# Altium project robot_control_pcb.PrjPCB
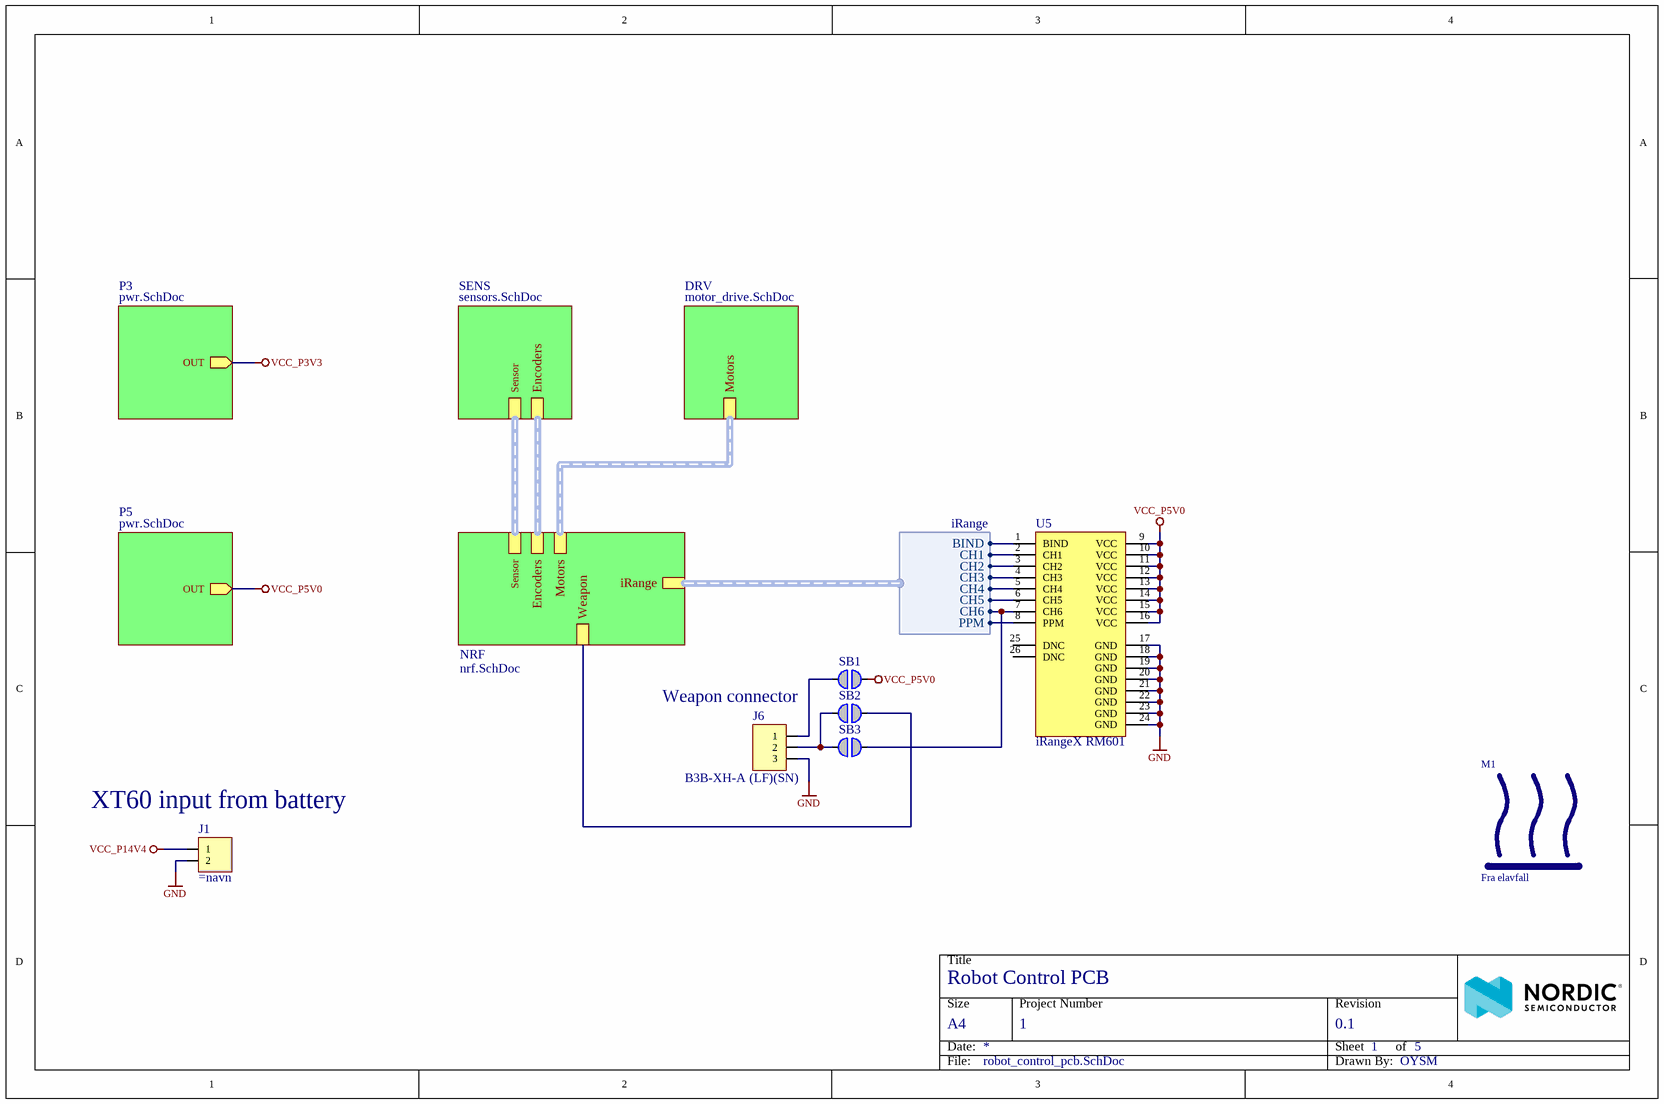
[diagram p0: robot_control_pcb.SchDoc]
5 sheets, 72 parts. Net scope: hierarchical (ports join the sheet entries above them; power ports are global).
Board file: robot_control_pcb.PcbDoc
Sheets:
  robot_control_pcb.SchDoc
    NRF = nrf.SchDoc
    DRV = motor_drive.SchDoc
    SENS = sensors.SchDoc
    P3 = pwr.SchDoc
    P5 = pwr.SchDoc

## Sheet robot_control_pcb.SchDoc: Robot Control PCB
size A4; Revision: 0.1; SheetNumber: 1; SheetTotal: 5; DrawnBy: OYSM; ProjectNumber: 1; DocumentSize: A4; PCAName: robot_control_pcb

### Parts
J1  (no value)  [XT60_Male_Vertical]
J6  B3B-XH-A (LF)(SN)  [JST_3P]
M1  Fra elavfall  [Heatsink_36x31x09]
SB1  Solderbridge  [Solderbridge]  (value not drawn)  (no BOM)
SB2  Solderbridge  [Solderbridge]  (value not drawn)  (no BOM)
SB3  Solderbridge  [Solderbridge]  (value not drawn)  (no BOM)
U5  iRangeX RM601  [iRangeX RM601]

### Sub-sheets
DRV = motor_drive.SchDoc: Motors (harness Motors)
NRF = nrf.SchDoc: Sensor (harness SENSOR), iRange (harness iRange), Encoders (harness Encoders), Motors (harness Motors), Weapon
P3 = pwr.SchDoc: OUT (out)
P5 = pwr.SchDoc: OUT (out)
SENS = sensors.SchDoc: Sensor (harness SENSOR), Encoders (harness Encoders)

### Harnesses
iRange: BIND, CH1, CH2, CH3, CH4, CH5, CH6, PPM

### Nets
GND: J1.2 J6.3 U5.17(GND) U5.18(GND) U5.19(GND) U5.20(GND) U5.21(GND) U5.22(GND) U5.23(GND) U5.24(GND)
VCC_P5V0: SB1.1 U5.9(VCC) U5.10(VCC) U5.11(VCC) U5.12(VCC) U5.13(VCC) U5.14(VCC) U5.15(VCC) U5.16(VCC) ; sheet P5/OUT
VCC_P14V4: J1.1
P0.14/WEP: SB2.1 ; sheet NRF/Weapon
P0.25/PPM: U5.8(PPM) ; sheet NRF/iRange.PPM
P0.26/CH6: SB3.1 U5.7(CH6) ; sheet NRF/iRange.CH6
P0.27/CH5: U5.6(CH5) ; sheet NRF/iRange.CH5
P0.28/CH4: U5.5(CH4) ; sheet NRF/iRange.CH4
P0.29/CH3: U5.4(CH3) ; sheet NRF/iRange.CH3
P0.30/CH2: U5.3(CH2) ; sheet NRF/iRange.CH2
P0.31/CH1: U5.2(CH1) ; sheet NRF/iRange.CH1
NetJ6_1: J6.1 SB1.2
NetJ6_2: J6.2 SB2.2 SB3.2
NetU5_1: U5.1(BIND) ; sheet NRF/iRange.BIND

Not connected (* = marked no-connect by the designer): U5 25(DNC) 26(DNC)

### Buses and harness runs
harness sheet DRV/Motors = sheet NRF/Motors
harness sheet NRF/Encoders = sheet SENS/Encoders
harness sheet NRF/Sensor = sheet SENS/Sensor

### Notes on the sheet
- Weapon connector
- (near J1) XT60 input from battery
- Title
- Size
- Date:
- A4
- Project Number
- Sheet         of
- Revision
- File:
- Drawn By:

### Library data of the parts
J1 = 4544: For å koble ledninger sammen; id: 4544
J6 = 4473: JST 3pin (pris pr. stk.); id: 4473; rad: 3; rom: OV; lager_type: Fremlager; dybde: 0; hylle: 6; antall: 100; pakke_opprettet_av: 815; leverandor_varenr: 1516277; pris: 2; nokkelord: Connector, Kontakt; leverandor: Farnell; pakketype: TH; komponenttype: 11; pakke_opprettet: 28.06.2014 18:25:12; symbol_opprettet_av: 815; symbol_opprettet: 28.06.2014 15:33:24; navn: B3B-XH-A (LF)(SN); produsent: JST
M1 = Heatsink
SB1-SB3 = Solderbridge: Artikkelnr Noca: N.A.; Part Number: Solderbridge; Manufacturer: *; Manufacturer Part Number: *; ComponentLink1URL: *; ComponentLink1Description: Datasheet; ComponentLink2URL: *; ComponentLink2Description: Supplier link; HelpURL: *; Footprint Doc: Solderbridge; LatestRevisionDate: 2009-12-14; Pin Count: 2; Publisher: Nordic Semiconductor; Published: 2009-12-14; Value: Solderbridge; Note: *; Supplier 1: *; Supplier Part Number 1: *; Supplier 2: *; Supplier Part Number 2: *; Part number IPS: N.A.

## Sheet nrf.SchDoc: PCA70107 MCU
size A4; DocumentNumber: 2; Revision: 0; SheetNumber: 2; SheetTotal: 5; ProjectNumber: <Project number>; DocumentSize: A4; PCBRevision: <PCB designer code>
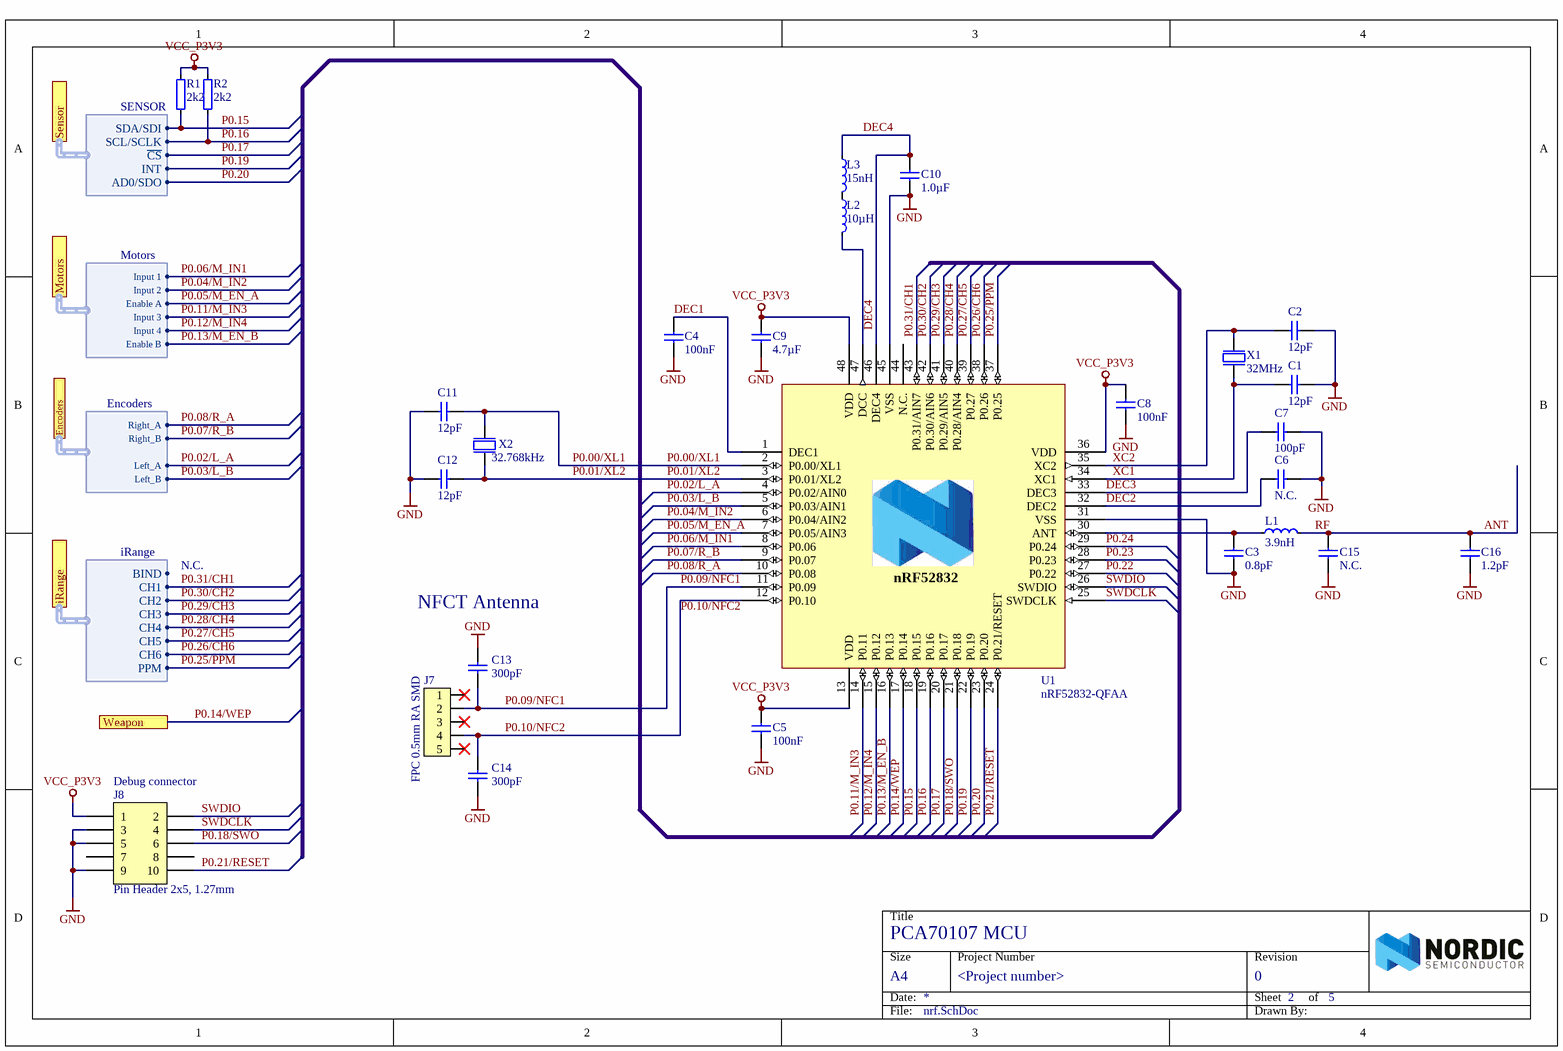
[diagram p1: nrf.SchDoc]

### Parts
C1  12pF  [CAPC1005X04L]
C2  12pF  [CAPC1005X04L]
C3  0.8pF  [CAPC1005X04L]
C4  100nF  [CAPC1005X04L]
C5  100nF  [CAPC1005X04L]
C6  N.C.  [CAPC1005X04L]
C7  100pF  [CAPC1005X04L]
C8  100nF  [CAPC1005X04L]
C9  4.7µF  [CAPC1608X06L]
C10  1.0µF  [CAPC1608X06L]
C11  12pF  [CAPC1005X04L]
C12  12pF  [CAPC1005X04L]
C13  300pF  [CAPC1005X04L]
C14  300pF  [CAPC1005X04L]
C15  N.C.  [CAPC1005X04L]
C16  1.2pF  [CAPC1005X04L]
J7  FPC 0.5mm RA SMD  [FPC_05P-0.5mm-RA-SMD]
J8  Pin Header 2x5, 1.27mm  [HDR_2x5-SMD-1.27mm-K]
L1  3.9nH  [INDC1005X04L]
L2  10µH  [INDC1608X06L]
L3  15nH  [INDC1005X04L]
R1  2k2  [RESC1005X04L]
R2  2k2  [RESC1005X04L]
U1  nRF52832-QFAA  [QFN40P600X600X90-48N]
X1  32MHz  [BT-XTAL_2016]
X2  32.768kHz  [XTAL_3215]

### Ports
Encoders (harness Encoders), iRange (harness iRange), Motors (harness Motors), Sensor (harness SENSOR), Weapon

### Harnesses
SENSOR: ~{CS}, INT, SDA/SDI, SCL/SCLK, AD0/SDO
Encoders: Right_A, Right_B, Left_A, Left_B
Motors: Input 1, Input 2, Input 3, Input 4, Enable A, Enable B
iRange: BIND, CH1, CH2, CH3, CH4, CH5, CH6, PPM

### Nets
GND: C1.2 C2.2 C3.1 C4.2 C5.2 C6.1 C7.2 C8.2 C9.2 C10.1 C11.2 C12.2 C13.2 C14.1 C15.2 C16.2 J8.3 J8.5 J8.9 U1.31(VSS) U1.45(VSS) U1.49(GND) X1.2(GND) X1.4(GND)
VCC_P3V3: C5.1 C8.1 C9.1 J8.1 R1.2 R2.2 U1.13(VDD) U1.36(VDD) U1.48(VDD)
ANT: C15.1 C16.1 L1.2  [also labelled RF]
DEC1: C4.1 U1.1(DEC1)
DEC2: C6.2 U1.32(DEC2)
DEC3: C7.1 U1.33(DEC3)
DEC4: C10.2 L3.1 U1.46(DEC4)
P0.00/XL1: C11.1 U1.2(P0.00/XL1) X2.1(inp)
P0.01/XL2: C12.1 U1.3(P0.01/XL2) X2.2(out)
P0.02/L_A: U1.4(P0.02/AIN0) ; port Encoders.Left_A
P0.03/L_B: U1.5(P0.03/AIN1) ; port Encoders.Left_B
P0.04/M_IN2: U1.6(P0.04/AIN2) ; port Motors.Input 2
P0.05/M_EN_A: U1.7(P0.05/AIN3) ; port Motors.Enable A
P0.06/M_IN1: U1.8(P0.06) ; port Motors.Input 1
P0.07/R_B: U1.9(P0.07) ; port Encoders.Right_B
P0.08/R_A: U1.10(P0.08) ; port Encoders.Right_A
P0.09/NFC1: C13.1 J7.2 U1.11(P0.09)
P0.10/NFC2: C14.2 J7.4 U1.12(P0.10)
P0.11/M_IN3: U1.14(P0.11) ; port Motors.Input 3
P0.12/M_IN4: U1.15(P0.12) ; port Motors.Input 4
P0.13/M_EN_B: U1.16(P0.13) ; port Motors.Enable B
P0.14/WEP: U1.17(P0.14) ; port Weapon
P0.15: R1.1 U1.18(P0.15) ; port Sensor.SDA/SDI
P0.16: R2.1 U1.19(P0.16) ; port Sensor.SCL/SCLK
P0.17: U1.20(P0.17) ; port Sensor.~{CS}
P0.18/SWO: J8.6 U1.21(P0.18)
P0.19: U1.22(P0.19) ; port Sensor.INT
P0.20: U1.23(P0.20) ; port Sensor.AD0/SDO
P0.21/RESET: J8.10 U1.24(P0.21/RESET)
P0.22: U1.27(P0.22)
P0.23: U1.28(P0.23)
P0.24: U1.29(P0.24)
P0.25/PPM: U1.37(P0.25) ; port iRange.PPM
P0.26/CH6: U1.38(P0.26) ; port iRange.CH6
P0.27/CH5: U1.39(P0.27) ; port iRange.CH5
P0.28/CH4: U1.40(P0.28/AIN4) ; port iRange.CH4
P0.29/CH3: U1.41(P0.29/AIN5) ; port iRange.CH3
P0.30/CH2: U1.42(P0.30/AIN6) ; port iRange.CH2
P0.31/CH1: U1.43(P0.31/AIN7) ; port iRange.CH1
SWDCLK: J8.4 U1.25(SWDCLK)
SWDIO: J8.2 U1.26(SWDIO)
XC1: C1.1 U1.34(XC1) X1.1(inp)
XC2: C2.1 U1.35(XC2) X1.3(out)
NetC3_2: C3.2 L1.1 U1.30(ANT)
NetL2_1: L2.1 L3.2
NetL2_2: L2.2 U1.47(DCC)

Not connected (* = marked no-connect by the designer): J7 1* 3* 5*; J8 7 8; U1 44(N.C.)

### Notes on the sheet
- N.C.
- NFCT Antenna
- (near J8) Debug connector
- Title
- Size
- Date:
- Project Number
- Sheet         of
- Revision
- File:
- Drawn By:
- (in symbol nRF52832-QFAA) nRF52832

### Library data of the parts
C1 C2 C11 C12 = C0402-12p: Capacitor, NP0, ±2%; Note: 50V; Artikkelnr Noca: 20029159; Artikkelnr Simpro: N.A.; Part Number: C0402-12p; Manufacturer: *; Manufacturer Part Number: *; Datasheet: *; LatestRevisionDate: 2011-05-11; Pin Count: 2; Publisher: Nordic Semiconductor; Published: 2009-05-08; Value: 12pF; Supplier: *; Supplier part number: *; 2nd source Supplier: *; 2nd source part number: *; Footprint Doc: 0402
C3 = C0402-0.8p: Capacitor, NP0, ±5%; Note: 50V; Artikkelnr Noca: 20029147; Artikkelnr Simpro: N.A.; Part Number: C0402-0.8p; Manufacturer: *; Manufacturer Part Number: *; Datasheet: *; LatestRevisionDate: 2012-11-21; Pin Count: 2; Publisher: Nordic Semiconductor; Published: 2009-05-08; Value: 0.8pF; Supplier: *; Supplier part number: *; 2nd source Supplier: *; 2nd source part number: *; Footprint Doc: 0402
C4 C5 C8 = C0402-100n: Capacitor, X7R, ±10%; Note: 16V; Artikkelnr Noca: 20039200; Artikkelnr Simpro: N.A.; Part Number: C0402-100n; Manufacturer: *; Manufacturer Part Number: *; Datasheet: *; LatestRevisionDate: 2009-11-23; Pin Count: 2; Publisher: Nordic Semiconductor; Published: 2009-05-08; Value: 100nF; Supplier: *; Supplier part number: *; 2nd source Supplier: *; 2nd source part number: *; Footprint Doc: 0402
C6 C15 = C0402-N.C.: Not mounted; Note: Chip Cap; Artikkelnr Noca: N.A.; Part Number: C0402-N.C.; Manufacturer: *; Manufacturer Part Number: *; Datasheet: *; LatestRevisionDate: 2009-05-08; Pin Count: 2; Publisher: Nordic Semiconductor; Published: 2009-05-08; Value: N.C.; Supplier: *; Supplier part number: *; 2nd source Supplier: *; 2nd source part number: *; Footprint Doc: 0402; Artikkelnr Simpro: N.A.
C7 = C0402-100p: Capacitor, NP0, ±5%; Note: 50V; Artikkelnr Noca: 20029135; Artikkelnr Simpro: N.A.; Part Number: C0402-100p; Manufacturer: *; Manufacturer Part Number: *; Datasheet: *; LatestRevisionDate: 2009-05-08; Pin Count: 2; Publisher: Nordic Semiconductor; Published: 2009-05-08; Value: 100pF; Supplier: *; Supplier part number: *; 2nd source Supplier: *; 2nd source part number: *; Footprint Doc: 0402
C9 = C0603-4µ7: Capacitor, X5R, ±10%; Note: 6.3V; Artikkelnr Noca: 20069060; Artikkelnr Simpro: N.A.; Part Number: C0603-4µ7; Manufacturer: *; Manufacturer Part Number: *; Datasheet: *; LatestRevisionDate: 2009-11-23; Pin Count: 2; Publisher: Nordic Semiconductor; Published: 2009-05-08; Value: 4.7µF; Supplier: *; Supplier part number: *; 2nd source Supplier: *; 2nd source part number: *; Footprint Doc: 0603
C10 = C0603-1µ0: Capacitor, X7R, ±10%; Note: 16V; Artikkelnr Noca: 20039335; Artikkelnr Simpro: N.A.; Part Number: C0603-1µ0; Manufacturer: *; Manufacturer Part Number: *; Datasheet: *; LatestRevisionDate: 2013-06-05; Pin Count: 2; Publisher: Nordic Semiconductor; Published: 2009-05-08; Value: 1.0µF; Supplier: *; Supplier part number: *; 2nd source Supplier: *; 2nd source part number: *; Footprint Doc: 0603
C13 C14 = C0402-300p: Capacitor, NP0, ±5%; Note: 50V; Artikkelnr Noca: N.A.; Part Number: C0402-300p; Manufacturer: *; Manufacturer Part Number: *; Datasheet: *; Footprint Doc: 0402; LatestRevisionDate: 2015-05-29; Pin Count: 2; Publisher: Nordic Semiconductor; Published: 2015-05-29; Value: 300pF; Supplier: Digi-Key; Supplier part number: 490-3234-1-ND; 2nd source Supplier: *; 2nd source part number: *; Artikkelnr Simpro: N.A.
C16 = C0402-1.2p: Capacitor, NP0, ±0.1pF; Note: 50V; Artikkelnr Noca: 20029157; Artikkelnr Simpro: N.A.; Part Number: C0402-1.2p; Manufacturer: *; Manufacturer Part Number: *; Datasheet: *; LatestRevisionDate: 2011-05-11; Pin Count: 2; Publisher: Nordic Semiconductor; Published: 2009-05-08; Value: 1.2pF; Supplier: *; Supplier part number: *; 2nd source Supplier: *; 2nd source part number: *; Footprint Doc: 0402
J7 = FPC_05P-0.5mm-RA-SMD: 0.5mm FPC, 5P,Right Angle SMT,Double Contact,H=1.2mm,White, Tin plated; Manufacturer: W-CON; Manufacturer Part Number: 5141-05RZDNWR01; 2nd source part number: WM9836CT-ND; Artikkelnr Noca: 55010020; Artikkelnr Simpro: N.A.; Part Number: FPC_05P-0.5mm-RA-SMD; Datasheet: \\hizz\pro\app9717\Datasheet\connectores\W-CON\5141-XXRZDNXX0X.pdf; Footprint Doc: FPC_05P-0.5mm-RA-SMD; LatestRevisionDate: 2016-04-21; Pin Count: 7; Publisher: Nordic Semiconductor; Published: 2015-06-22; Value: FPC 0.5mm RA SMD; Note: *; Supplier: Cabcon; Supplier part number: 5141-05RZDNWR01; 2nd source Supplier: Digi-Key
J8 = Pin Header 2x5 SMD, 1.27mm, KS: Pin Header 2x5, 1.27mm (50mil), SMD, Keying Shroud; Manufacturer: W-CON; Manufacturer Part Number: 3132-10MS0BK00R1; 2nd source part number: FTSH-105-01-F-DV-K; Artikkelnr Noca: 55010009; Artikkelnr Simpro: N.A.; Part Number: Pin Header 2x5 SMD, 1.27mm, KS; Datasheet: \\hizz\pro\app9717\Datasheet\connectores\W-CON\3132-XXMXXBK00XX.pdf; Footprint Doc: HDR_2x5-SMD-1.27mm; LatestRevisionDate: 2016-04-21; Pin Count: 10; Publisher: Nordic Semiconductor; Published: 2016-01-22; Value: Pin Header 2x5, 1.27mm; Note: *; Supplier: Cabcon; Supplier part number: 3132-10MS0BK00R1; 2nd source Supplier: Samtec
L1 = L0402-3n9: High frequency chip inductor ±5%; Manufacturer: Murata; Manufacturer Part Number: LQP15MN3N9B02D; Artikkelnr Noca: 33029151; Artikkelnr Simpro: N.A.; Part Number: L0402-3n9; Datasheet: http://search.murata.co.jp/Ceramy/image/img/PDF/ENG/L0075S0084LQP15M.pdf; LatestRevisionDate: 2012-09-19; Pin Count: 2; Publisher: Nordic Semiconductor; Published: 2009-05-08; Value: 3.9nH; Note: High frequency chip inductor ±5%; Supplier: Digi-Key; Supplier part number: 490-1131-1-ND; 2nd source Supplier: *; 2nd source part number: *; Footprint Doc: 0402
L2 = L0603-10µ: Chip inductor, IDC,min = 50 mA, ±20%; Manufacturer: Taiyo Yuden; Manufacturer Part Number: LBMF1608T100K; 2nd source part number: 178-6105; Note: LBMF1608T100K 10µH 80mA 0603; Artikkelnr Noca: 33029314; Artikkelnr Simpro: N.A.; Part Number: L0603-10µ; Datasheet: http://www.yuden.co.jp/ut/product/pdf/elb2_e.pdf; LatestRevisionDate: 2012-09-19; Pin Count: 2; Publisher: Nordic Semiconductor; Published: 2010-02-24; Value: 10µH; Supplier: Digi-Key; Supplier part number: 587-1714-1-ND; 2nd source Supplier: Farnell; Footprint Doc: 0603
L3 = L0402-15n: High frequency chip inductor ±10%; Manufacturer: Taiyo Yuden; Manufacturer Part Number: HK100515NJ-T; 2nd source part number: 658-1328; Artikkelnr Noca: 33029323; Artikkelnr Simpro: N.A.; Part Number: L0402-15n; LatestRevisionDate: 2012-09-19; Pin Count: 2; Publisher: Nordic Semiconductor; Published: 2010-07-12; Value: 15nH; Note: High frequency chip inductor ±10%; Supplier: Digi-Key; Datasheet: http://www.yuden.co.jp/productdata/catalog/en/mlci04_e.pdf; Supplier part number: 587-1521-1-ND; 2nd source Supplier: Farnell; Footprint Doc: 0402
R1 R2 = R0402-2k2: Resistor, ±1%, 0.063W; Part number IPS: N.A.; Note: Chip Res 1%; Artikkelnr Noca: 27049081; Part Number: R0402-2k2; Manufacturer: *; Manufacturer Part Number: *; ComponentLink1URL: *; ComponentLink1Description: Datasheet; ComponentLink2URL: *; ComponentLink2Description: Supplier link; HelpURL: *; Footprint Doc: 0402; LatestRevisionDate: 2009-11-23; Pin Count: 2; Publisher: Nordic Semiconductor; Published: 2009-05-08; Value: 2k2; Supplier 1: Farnell; Supplier Part Number 1: 173-8854; Supplier 2: *; Supplier Part Number 2: *
U1 = nRF52832-QFAA: Multi-protocol Bluetooth Low Energy and 2.4GHz proprietary system-on-chip; Manufacturer: Nordic Semiconductor; Artikkelnr Noca: N.A.; Part Number: nRF52832-QFAA; Manufacturer Part Number: nRF52832-QFAA; Datasheet: *; LatestRevisionDate: 2014-11-26; Pin Count: 48; Publisher: Nordic Semiconductor; Published: 2014-11-26; Value: nRF52832-QFAA; Note: *; Supplier: Nordic Semiconductor; Supplier part number: *; 2nd source Supplier: *; 2nd source part number: *; Footprint Doc: QFN-48; Artikkelnr Simpro: N.A.
X1 = XTAL_SMD2016_32MHz_8pF_Epson: XTAL SMD 2016, 32MHz, Cl=8pF, Total Tol: ±40ppm; Manufacturer: Epson Toyocom; Manufacturer Part Number: Q22FA12800025; Note: XTAL SMD 32.000MHz; Artikkelnr Noca: N.A.; Part Number: XTAL_SMD2016_32MHz_8pF_Epson; Datasheet: http://www.epsondevice.com/docs/qd/en/DownloadServlet?id=ID000449; LatestRevisionDate: 2014-11-27; Pin Count: 4; Publisher: Nordic Semiconductor; Published: 2012-03-09; Value: 32MHz; Supplier: Farnell; Supplier part number: 171-2806; 2nd source Supplier: *; 2nd source part number: *; Footprint Doc: XTAL_2016; Artikkelnr Simpro: N.A.
X2 = XTAL_FC-135 32.768k: XTAL SMD 3215, 32.768kHz, 9pF, ±20ppm; Manufacturer: Epson Toyocom; Manufacturer Part Number: FC-135 32.768KHZ ±20PPM,9.0PF; 2nd source part number: 127-8037; Note: XTAL SMD 32.768kHz, 3215; Artikkelnr Noca: 22019091; Artikkelnr Simpro: N.A.; Part Number: XTAL_FC-135 32.768k; Datasheet: http://www.farnell.com/datasheets/57480.pdf; LatestRevisionDate: 2014-03-27; Pin Count: 2; Publisher: Nordic Semiconductor; Published: 2010-10-18; Value: 32.768kHz; Supplier: Digi-Key; Supplier part number: FC-135 32.7680KA-AC-ND; 2nd source Supplier: Farnell; Footprint Doc: XTAL_3215

## Sheet motor_drive.SchDoc: Robot Control PCB
size A4; Revision: 0.1; SheetNumber: 3; SheetTotal: 5; DrawnBy: OYSM; ProjectNumber: 1; DocumentSize: A4; PCAName: robot_control_pcb
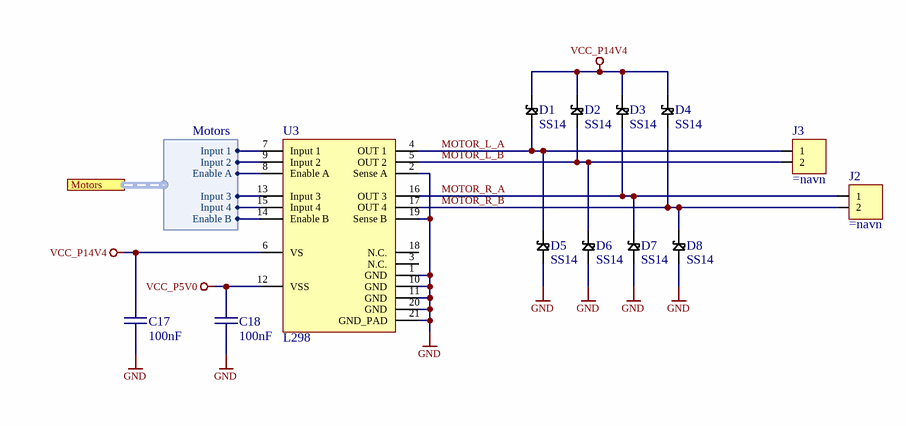
[diagram p2: motor_drive.SchDoc]

### Parts
C17  100nF  [CAPC0603(1608)55_N]
C18  100nF  [CAPC0603(1608)55_N]
D1  SS14  [SMA_DO-214AC]
D2  SS14  [SMA_DO-214AC]
D3  SS14  [SMA_DO-214AC]
D4  SS14  [SMA_DO-214AC]
D5  SS14  [SMA_DO-214AC]
D6  SS14  [SMA_DO-214AC]
D7  SS14  [SMA_DO-214AC]
D8  SS14  [SMA_DO-214AC]
J2  (no value)  [XT30_Female_Vertical]
J3  (no value)  [XT30_Female_Vertical]
U3  L298  [SOIC127P1420X360_HS-21M]

### Ports
Motors (harness Motors)

### Harnesses
Motors: Input 1, Input 2, Input 3, Input 4, Enable A, Enable B

### Nets
GND: C17.1 C18.1 D5.1(A) D6.1(A) D7.1(A) D8.1(A) U3.1(GND) U3.2(Sense_A) U3.10(GND) U3.11(GND) U3.19(Sense_B) U3.20(GND) U3.21(GND_PAD)
VCC_P5V0: C18.2 U3.12(VSS)
VCC_P14V4: C17.2 D1.2(K) D2.2(K) D3.2(K) D4.2(K) U3.6(VS)
MOTOR_L_A: D1.1(A) D5.2(K) J3.1 U3.4(OUT_1)
MOTOR_L_B: D2.1(A) D6.2(K) J3.2 U3.5(OUT_2)
MOTOR_R_A: D3.1(A) D7.2(K) J2.1 U3.16(OUT_3)
MOTOR_R_B: D4.1(A) D8.2(K) J2.2 U3.17(OUT_4)
P0.04/M_IN2: U3.9(Input_2) ; port Motors.Input 2
P0.05/M_EN_A: U3.8(Enable_A) ; port Motors.Enable A
P0.06/M_IN1: U3.7(Input_1) ; port Motors.Input 1
P0.11/M_IN3: U3.13(Input_3) ; port Motors.Input 3
P0.12/M_IN4: U3.15(Input_4) ; port Motors.Input 4
P0.13/M_EN_B: U3.14(Enable_B) ; port Motors.Enable B

Not connected (* = marked no-connect by the designer): U3 3(N.C.) 18(N.C.)

### Notes on the sheet
- Title
- Size
- Date:
- A4
- Project Number
- Sheet         of
- Revision
- File:
- Drawn By:

### Library data of the parts
C17 C18 = 5152: X7R 50V 5%; id: 5152; rad: 21; rom: OV; lager_type: Baklager; dybde: 0; antall: 1000; pakke_opprettet_av: 815; leverandor_varenr: 1759122; pris: 1; nokkelord: Kondensator, Capacitor, CAP; produsent: Multikomp; leverandor: Farnell; pakketype: 0603; komponenttype: 2; hylle: 0; pakke_opprettet: 2015-02-18 14:18:13; symbol_opprettet_av: 815; symbol_opprettet: 2014-11-14 20:19:34; navn: 100nF
D1-D8 = 5642: id: 5642; pakke_opprettet_av: 815; beskrivelse: SS14-E3/61T - Schottky Rectifier, 40 V, 1 A, Single, DO-214AC, 2 Pins, 500 mV; leverandor_varenr: 9551280; pris: 4; nokkelord: Diode; produsent: Vishay; leverandor: Farnell; pakketype: DO; komponenttype: 9; pakke_opprettet: 19/01/2020 14:48:44; symbol_opprettet_av: 815; symbol_opprettet: 28/06/2014 15:20:09; navn: SS14
J2 J3 = 4550: Pris per del, For å koble ledninger sammen; id: 4550
U3 = 5620: Dual H Bridge; id: 5620; pakke_opprettet_av: 815; leverandor_varenr: 2762686; pris: 84; nokkelord: h-bro, h-bridge, driver, motor driver, motordriver, l298n; produsent: ST; leverandor: Farnell; pakketype: SMD; komponenttype: 15; pakke_opprettet: 18.01.2020 20:43:17; symbol_opprettet_av: 815; symbol_opprettet: 18.01.2020 20:24:51; navn: L298

## Sheet sensors.SchDoc: Robot Control PCB
size A4; Revision: 0.1; SheetNumber: 4; SheetTotal: 5; DrawnBy: OYSM; ProjectNumber: 1; DocumentSize: A4; PCAName: robot_control_pcb
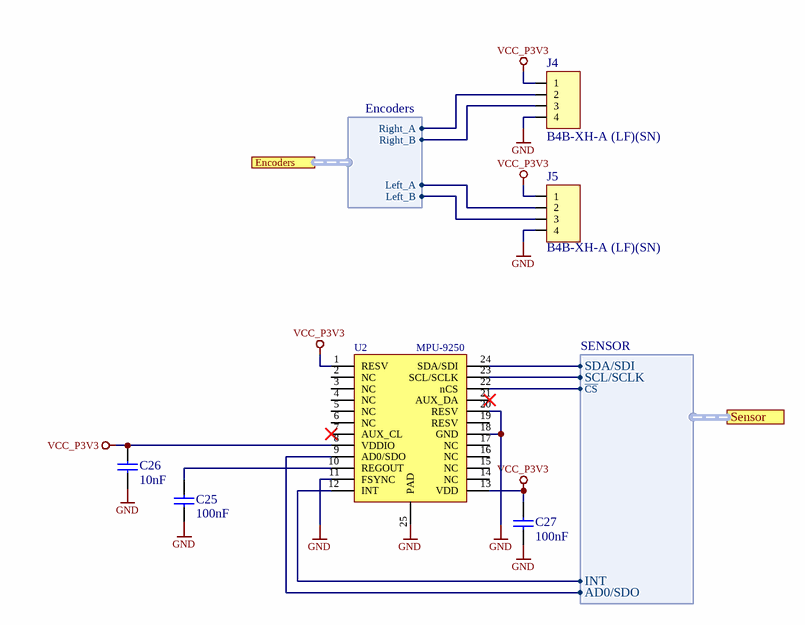
[diagram p3: sensors.SchDoc]

### Parts
C25  100nF  [CAPC1005X04L]
C26  10nF  [CAPC1005X04L]
C27  100nF  [CAPC1005X04L]
J4  B4B-XH-A (LF)(SN)  [JST_4P]
J5  B4B-XH-A (LF)(SN)  [JST_4P]
U2  MPU-9250  [QFN05P40X40X02-24]

### Ports
Encoders (harness Encoders), Sensor (harness SENSOR)

### Harnesses
SENSOR: SDA/SDI, SCL/SCLK, ~{CS}, INT, AD0/SDO
Encoders: Right_A, Right_B, Left_A, Left_B

### Nets
GND: C25.2 C26.1 C27.2 J4.4 J5.4 U2.11(FSYNC) U2.18(GND) U2.20(RESV) U2.25(PAD)
VCC_P3V3: C26.2 C27.1 J4.1 J5.1 U2.1(RESV) U2.8(VDDIO) U2.13(VDD)
P0.02/L_A: J5.2 ; port Encoders.Left_A
P0.03/L_B: J5.3 ; port Encoders.Left_B
P0.07/R_B: J4.3 ; port Encoders.Right_B
P0.08/R_A: J4.2 ; port Encoders.Right_A
P0.15: U2.24(SDA/SDI) ; port Sensor.SDA/SDI
P0.16: U2.23(SCL/SCLK) ; port Sensor.SCL/SCLK
P0.17: U2.22(nCS) ; port Sensor.~{CS}
P0.19: U2.12(INT) ; port Sensor.INT
P0.20: U2.9(AD0/SDO) ; port Sensor.AD0/SDO
NetC25_1: C25.1 U2.10(REGOUT)

Not connected (* = marked no-connect by the designer): U2 2(NC) 3(NC) 4(NC) 5(NC) 6(NC) 7(AUX_CL)* 14(NC) 15(NC) 16(NC) 17(NC) 19(RESV) 21(AUX_DA)*

### Notes on the sheet
- Title
- Size
- Date:
- A4
- Project Number
- Sheet         of
- Revision
- File:
- Drawn By:

### Library data of the parts
C25 C27 = C0402-100n: as C4 on sheet nrf; Part Number: C0402-100n; Manufacturer: *; Manufacturer Part Number: *; Datasheet: *; LatestRevisionDate: 2009-11-23; Pin Count: 2; Publisher: Nordic Semiconductor; Published: 2009-05-08; Value: 100nF; Supplier: *; Supplier part number: *; 2nd source Supplier: *; 2nd source part number: *; Footprint Doc: 0402
C26 = C0402-10n: Capacitor, X7R, ±10%; Part number IPS: 00000007784; Note: 16V; Artikkelnr Noca: 20039166; Part Number: C0402-10n; Manufacturer: *; Manufacturer Part Number: *; ComponentLink1URL: *; ComponentLink1Description: Datasheet; ComponentLink2URL: *; ComponentLink2Description: Supplier link; HelpURL: *; Footprint Doc: 0402; LatestRevisionDate: 2009-11-23; Pin Count: 2; Publisher: Nordic Semiconductor; Published: 2009-05-08; Value: 10nF; Supplier 1: *; Supplier Part Number 1: *; Supplier 2: *; Supplier Part Number 2: *
J4 J5 = 3046: id: 3046; rad: 3; rom: OV; lager_type: Fremlager; dybde: 0; hylle: 6; antall: 100; pakke_opprettet_av: 815; beskrivelse: JST 4pin (pris pr. stk.); leverandor_varenr: 1516278; pris: 2; nokkelord: Connector, Kontakt; produsent: JST; leverandor: Farnell; pakketype: TH; komponenttype: 11; pakke_opprettet: 28.06.2014 18:25:23; symbol_opprettet_av: 815; symbol_opprettet: 28.06.2014 15:33:28; navn: B4B-XH-A (LF)(SN)
U2 = 5302: =beskrivelse; rad: 4; rom: OV; lager_type: Fremlager; dybde: 0; hylle: 2; antall: 40; pakke_opprettet_av: 815; nokkelord: Narrow Band Multi-Channel RF Transceiver Module; pakketype: QFN; produsent: InvenSense; id: 5302; beskrivelse: MotionTracking device; komponenttype: 6; navn: MPU-9250; kolonne: 4; pakke_opprettet: 22.01.2016 16:18:46; symbol_opprettet_av: 815; symbol_opprettet: 22.01.2016 16:19:50; pris: 0

## Sheet pwr.SchDoc: Robot Control PCB
size A4; Revision: 0.1; SheetNumber: 5; SheetTotal: 5; DrawnBy: OYSM; ProjectNumber: 1; DocumentSize: A4; PCAName: robot_control_pcb
Used 2 times, as channels P3, P5. Parts and nets are listed once, with the designators drawn on the sheet.
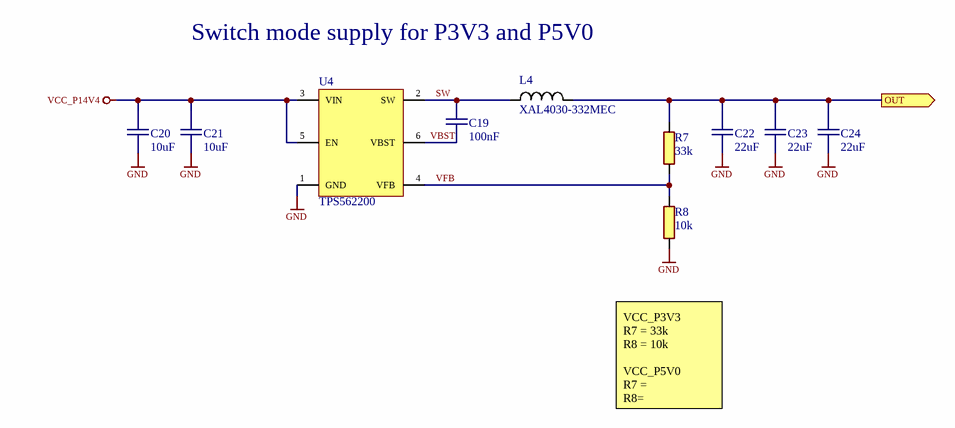
[diagram p4: pwr.SchDoc]

### Parts
C19  100nF  [CAPC0603(1608)55_N]
C20  10uF  [CAPC1206(3216)170_N]
C21  10uF  [CAPC1206(3216)170_N]
C22  22uF  [CAPC1206(3216)170_N]
C23  22uF  [CAPC1206(3216)170_N]
C24  22uF  [CAPC1206(3216)170_N]
L4  XAL4030-332MEC  [XAL4030]
R7  33k  [RESC0603(1608)_N]
R8  10k  [RESC0603(1608)_N]
U4  TPS562200  [SOT95P280X145-6N]

### Ports
OUT (out)

### Nets
GND: C20.1 C21.1 C22.1 C23.1 C24.1 R8.1 U4.1(GND)
VCC_P14V4: C20.2 C21.2 U4.3(VIN) U4.5(EN)
OUT: C22.2 C23.2 C24.2 L4.2 R7.2 ; port OUT
SW: C19.2 L4.1 U4.2(SW)
VBST: C19.1 U4.6(VBST)
VFB: R7.1 R8.2 U4.4(VFB)

### Channels
P3: ports OUT=VCC_P3V3
P5: designators end in _P5; ports OUT=VCC_P5V0

### Notes on the sheet
- Switch mode supply for P3V3 and P5V0
- VCC_P3V3
  R7 = 33k
  R8 = 10k
  VCC_P5V0
  R7 =
  R8=
- Title
- Size
- Date:
- A4
- Project Number
- Sheet         of
- Revision
- File:
- Drawn By:

### Library data of the parts
C19 = 5152: as C17 on sheet motor_drive; hylle: 0; pakke_opprettet: 18.02.2015 14:18:13; symbol_opprettet_av: 815; symbol_opprettet: 14.11.2014 20:19:34; navn: 100nF
C20 C21 = 5059: X5R 50V 10%; id: 5059; pakke_opprettet_av: 815; leverandor_varenr: 1845762; pris: 6; nokkelord: Kondensator, capacitor; produsent: Murata; leverandor: Farnell; pakketype: 1206; komponenttype: 2; pakke_opprettet: 11.02.2015 13:21:22; symbol_opprettet_av: 815; symbol_opprettet: 14.11.2014 20:19:34; navn: 10uF
C22-C24 = 5192: 10V 10% Tantalum; id: 5192; pakke_opprettet_av: 815; leverandor_varenr: 1457420; pris: 3; nokkelord: Capacitor Cap Kondis; produsent: Kemet; leverandor: Farnell; pakketype: 1206; komponenttype: 2; pakke_opprettet: 11.02.2015 13:21:22; symbol_opprettet_av: 815; symbol_opprettet: 14.11.2014 20:19:34; navn: 22uF
L4 = 5644: 3.3µH; id: 5644; pakke_opprettet_av: 815; symbol_opprettet_av: 924; leverandor_varenr: 2289055; pris: 40; nokkelord: 3.3uH, 3u3H, 3,3uH, 3µ3H; produsent: Coilcraft; leverandor: Farnell; pakketype: SMD; komponenttype: 3; pakke_opprettet: 23.01.2020 22:27:27; symbol_opprettet: 27.05.2015 00:20:21; navn: XAL4030-332MEC
R7 = 5397: 0.1W 1% Thick film resistor; id: 5397; rad: -1; rom: OV; lager_type: Fremlager; dybde: 84; hylle: 2; antall: 100; pakke_opprettet_av: 815; pris: 0; pakketype: 0603; komponenttype: 1; pakke_opprettet: 08.07.2014 21:15:30; symbol_opprettet_av: 815; symbol_opprettet: 08.07.2014 21:16:33; navn: 33k
R8 = 5264: 0.1W 1% Thick film resistor; id: 5264; rad: 1; rom: OV; lager_type: Baklager; dybde: 3; hylle: 6; antall: 1200; pakke_opprettet_av: 815; leverandor_varenr: 2447230; pris: 0; nokkelord: Resistor Motstand; produsent: Multikomp; leverandor: Farnell; pakketype: 0603; pakke_opprettet: 08.07.2014 21:15:30; symbol_opprettet_av: 815; symbol_opprettet: 08.07.2014 21:16:33; navn: 10k; komponenttype: 1
U4 = 5645: id: 5645; pakke_opprettet_av: 1335; symbol_opprettet_av: 815; beskrivelse: DC-DC Switching Buck Step Down Regulator, Adjustable, 4.5V-17Vin, 760mV-7Vout, 2Aout; leverandor_varenr: 2420234; pris: 12; produsent: Texas Instruments; leverandor: Farnell; pakketype: SOT-23; komponenttype: 15; pakke_opprettet: 25.11.2016 18:04:01; symbol_opprettet: 23.01.2020 22:46:07; navn: TPS562200

## Nets that join several sheets
GND: robot_control_pcb (10 pins), nrf (24 pins), motor_drive (13 pins), sensors (9 pins), P3 (7 pins), P5 (7 pins)
VCC_P3V3: nrf (9 pins), sensors (7 pins), P3 (5 pins)
VCC_P5V0: robot_control_pcb (9 pins), motor_drive (C18.2 U3.12), P5 (5 pins)
VCC_P14V4: robot_control_pcb (J1.1), motor_drive (6 pins), P3 (C20.2 C21.2 U4.3 U4.5), P5 (C20_P5.2 C21_P5.2 U4_P5.3 U4_P5.5)
P0.02/L_A: nrf (U1.4), sensors (J5.2)
P0.03/L_B: nrf (U1.5), sensors (J5.3)
P0.04/M_IN2: nrf (U1.6), motor_drive (U3.9)
P0.05/M_EN_A: nrf (U1.7), motor_drive (U3.8)
P0.06/M_IN1: nrf (U1.8), motor_drive (U3.7)
P0.07/R_B: nrf (U1.9), sensors (J4.3)
P0.08/R_A: nrf (U1.10), sensors (J4.2)
P0.11/M_IN3: nrf (U1.14), motor_drive (U3.13)
P0.12/M_IN4: nrf (U1.15), motor_drive (U3.15)
P0.13/M_EN_B: nrf (U1.16), motor_drive (U3.14)
P0.14/WEP: robot_control_pcb (SB2.1), nrf (U1.17)
P0.15: nrf (R1.1 U1.18), sensors (U2.24)
P0.16: nrf (R2.1 U1.19), sensors (U2.23)
P0.17: nrf (U1.20), sensors (U2.22)
P0.19: nrf (U1.22), sensors (U2.12)
P0.20: nrf (U1.23), sensors (U2.9)
P0.25/PPM: robot_control_pcb (U5.8), nrf (U1.37)
P0.26/CH6: robot_control_pcb (SB3.1 U5.7), nrf (U1.38)
P0.27/CH5: robot_control_pcb (U5.6), nrf (U1.39)
P0.28/CH4: robot_control_pcb (U5.5), nrf (U1.40)
P0.29/CH3: robot_control_pcb (U5.4), nrf (U1.41)
P0.30/CH2: robot_control_pcb (U5.3), nrf (U1.42)
P0.31/CH1: robot_control_pcb (U5.2), nrf (U1.43)